# EAGLE board circuit (EAGLE 5.10)
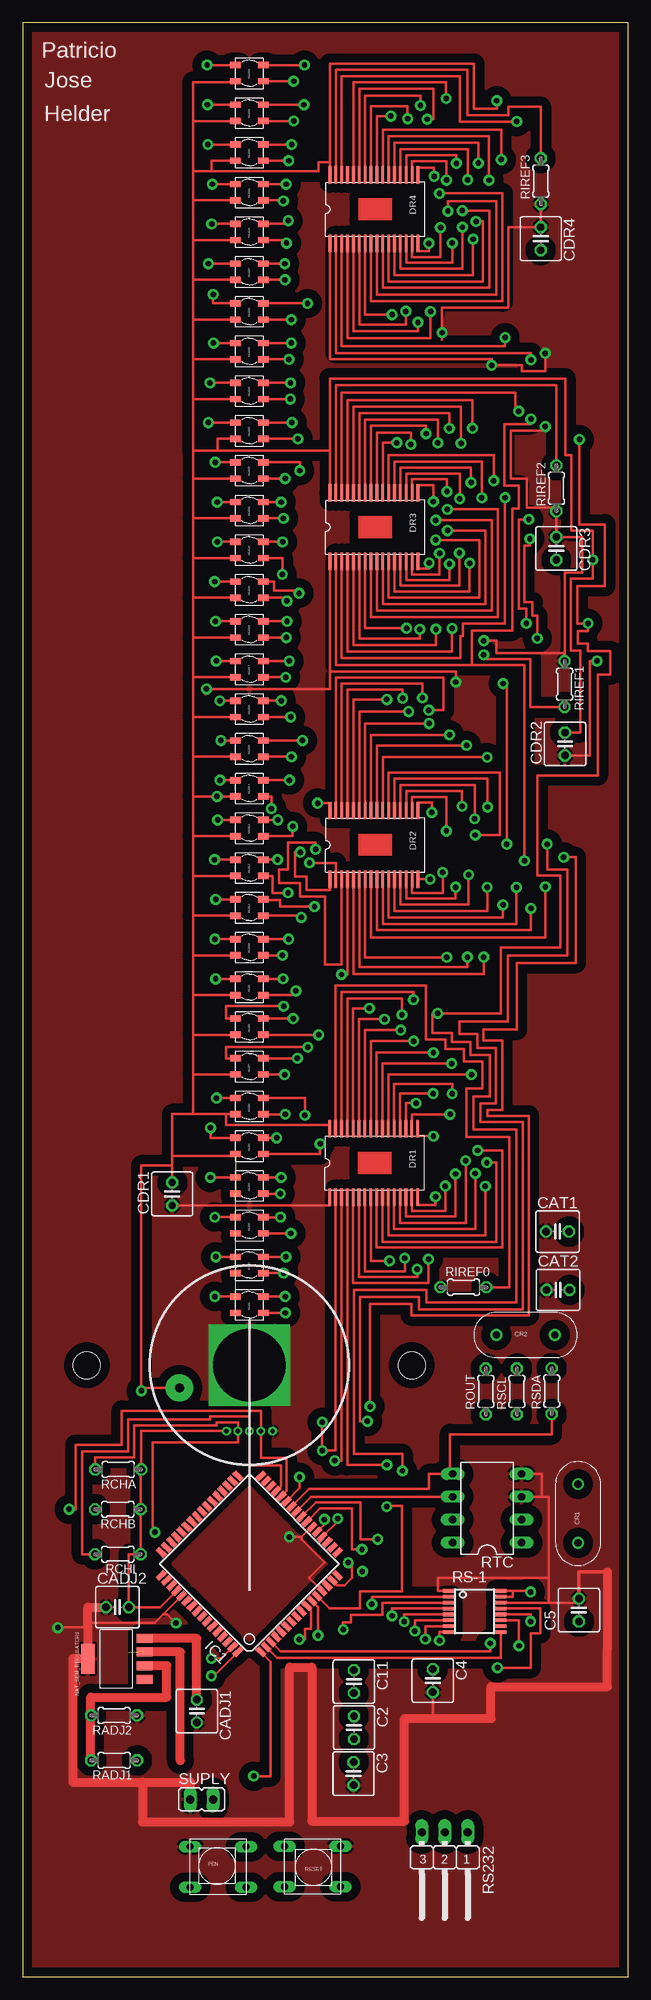
[diagram p1: board, top side]
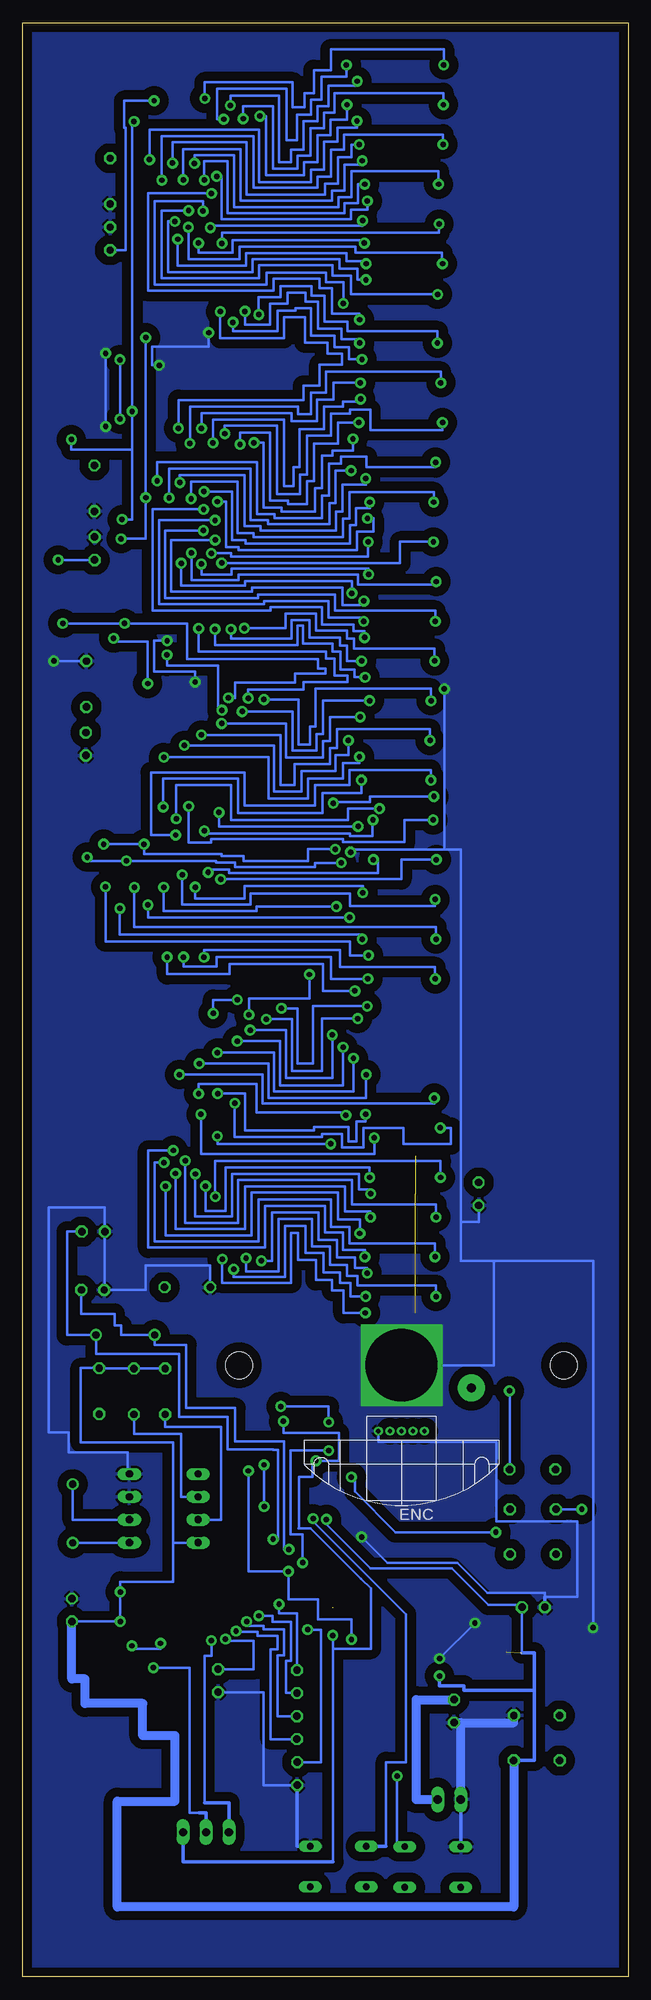
[diagram p2: board, bottom side, seen from below]

Size 67.12 x 216.45 mm. Coordinates in mm from the lower left corner, seen from the top.
Outline: 0,0 67.12,0 67.12,216.45 0,216.45 0,0
Copper layers (1*16): Top 0.035mm / dielectric 1.5mm / Bottom 0.035mm
Design rules "default1 *": minimum track width 10mil, minimum drill 0.6mm, track to track 0.3mm, track to pad 0.3mm, pad to pad 8mil, via to via 8mil, smd to smd 8mil, copper to edge 40mil, drill to drill 8mil, minimum pad ring 10mil, minimum via ring 8mil, stop-mask expansion 4mil, vias tented up to drill 0mil, thermal gap 10mil
Holes 3 mm at 7.13,67.75 43.13,67.75

## Footprints (pad centres in the part's own frame; a part is rotated, then mirrored left to right if it is on the bottom)
CAP = drill 0.813 octagon: 1 -1.27,0; 2 1.27,0
CRYSTAL2 = drill 0.8 round: 1 2.5,2.5; 2 9,2.5
TLC5947 = smd 1.9 x 0.3: 1 -0.8,10.5; 2 -0.8,9.85; 3 -0.8,9.2; 4 -0.8,8.55; 5 -0.8,7.9; 6 -0.8,7.25; 7 -0.8,6.6; 8 -0.8,5.95; 9 -0.8,5.3; 10 -0.8,4.65; 11 -0.8,4; 12 -0.8,3.35; 13 -0.8,2.7; 14 -0.8,2.05; 15 -0.8,1.4; 16 -0.8,0.75; 17 6.8,0.75; 18 6.8,1.4; 19 6.8,2.05; 20 6.8,2.7; 21 6.8,3.35; 22 6.8,4; 23 6.8,4.65; 24 6.8,5.3; 25 6.8,5.95; 26 6.8,6.6; 27 6.8,7.25; 28 6.8,7.9; 29 6.8,8.55; 30 6.8,9.2; 31 6.8,9.85; 32 6.8,10.5
ENCODER-AED8-9140 = drill 0.47 pad 0.7 round: 1 -2.54,-3.7; 2 -1.27,-3.7; 3 0,-3.7; 4 1.27,-3.7; 5 2.57,-3.7
TQFP64 = smd 1.194 x 0.559: 1 -7.8,6; 2 -7.8,5.2; 3 -7.8,4.4; 4 -7.8,3.6; 5 -7.8,2.8; 6 -7.8,2; 7 -7.8,1.2; 8 -7.8,0.4; 9 -7.8,-0.4; 10 -7.8,-1.2; 11 -7.8,-2; 12 -7.8,-2.8; 13 -7.8,-3.6; 14 -7.8,-4.4; 15 -7.8,-5.2; 16 -7.8,-6; 33 7.8,-6; 34 7.8,-5.2; 35 7.8,-4.4; 36 7.8,-3.6; 37 7.8,-2.8; 38 7.8,-2; 39 7.8,-1.2; 40 7.8,-0.4; 41 7.8,0.4; 42 7.8,1.2; 43 7.8,2; 44 7.8,2.8; 45 7.8,3.6; 46 7.8,4.4; 47 7.8,5.2; 48 7.8,6 | smd 0.559 x 1.194: 17 -6,-7.8; 18 -5.2,-7.8; 19 -4.4,-7.8; 20 -3.6,-7.8; 21 -2.8,-7.8; 22 -2,-7.8; 23 -1.2,-7.8; 24 -0.4,-7.8; 25 0.4,-7.8; 26 1.2,-7.8; 27 2,-7.8; 28 2.8,-7.8; 29 3.6,-7.8; 30 4.4,-7.8; 31 5.2,-7.8; 32 6,-7.8; 49 6,7.8; 50 5.2,7.8; 51 4.4,7.8; 52 3.6,7.8; 53 2.8,7.8; 54 2,7.8; 55 1.2,7.8; 56 0.4,7.8; 57 -0.4,7.8; 58 -1.2,7.8; 59 -2,7.8; 60 -2.8,7.8; 61 -3.6,7.8; 62 -4.4,7.8; 63 -5.2,7.8; 64 -6,7.8
NAT_SEM_REGULATOR = smd 1 x 1.75: ADJ -1.25,-3.45; VEN -2.75,-3.45; VIN 1.75,-3.45; VOUT 0.25,-3.45 | smd 3.3 x 1.5: GND -0.5,2.85
PUSH_BUTTON = drill 0.75 long: 1 0,-0.85; 2 0,-5.35; 3 6.2,-0.85; 4 6.2,-5.35
0204/5 = drill 0.813 octagon: 1 -2.54,0; 2 2.54,0
ASMT-QTB0-0AA02-LED = smd 0.7 x 1.2: B 2.6,-0.05; G 2.6,-3.15; R 0.8,-3.15; VCC 0.8,-0.05
JP2W = drill 0.914 long: 1 -2.54,-1.27; 2 0,-1.27; 3 2.54,-1.27
TRS3221 = smd 0.4 x 1.2: 1 -2.275,-2.9; 2 -1.625,-2.9; 3 -0.975,-2.9; 4 -0.325,-2.9; 5 0.325,-2.9; 6 0.975,-2.9; 7 1.625,-2.9; 8 2.275,-2.9; 9 2.275,2.9; 10 1.625,2.9; 11 0.975,2.9; 12 0.325,2.9; 13 -0.325,2.9; 14 -0.975,2.9; 15 -1.625,2.9; 16 -2.275,2.9
DIL08 = drill 0.813 long: 1 -3.81,-3.81; 2 -1.27,-3.81; 3 1.27,-3.81; 4 3.81,-3.81; 5 3.81,3.81; 6 1.27,3.81; 7 -1.27,3.81; 8 -3.81,3.81
JP1 = drill 0.914 long: 1 0,-1.27; 2 0,1.27

## Placement (x,y rotation side)
C2  CAP  [CAP]  36.72,27.61 270 top
C3  CAP  [CAP]  36.68,22.51 270 top
C4  CAP  [CAP]  45.46,32.81 270 top
C5  CAP  [CAP]  61.65,40.63 90 top
C11  CAP  [CAP]  36.71,32.71 270 top
CADJ1  0.1u  [CAP]  19.31,29.44 270 top
CADJ2  0.1u  [CAP]  10.51,40.95 0 top
CAT1  CAP  [CAP]  59.28,82.55 0 top
CAT2  CAP  [CAP]  59.34,76.09 0 top
CDR1  CAP  [CAP]  16.58,86.72 90 top
CDR2  CAP  [CAP]  60.11,136.55 90 top
CDR3  CAP  [CAP]  59.15,158.21 270 top
CDR4  CAP  [CAP]  57.42,192.51 270 top
CR1  37.768k  [CRYSTAL2]  64.06,45.58 90 top
CR2  16MHz  [CRYSTAL2]  49.99,68.59 0 top
DR1  TLC5947  [TLC5947]  44.53,87.15 90 top
DR2  TLC5947  [TLC5947]  44.56,122.37 90 top
DR3  TLC5947  [TLC5947]  44.56,157.57 90 top
DR4  TLC5947  [TLC5947]  44.56,192.78 90 top
ENC  ENCODER-AEDB-9140  [ENCODER-AED8-9140]  25.13,56.75 180 bottom
IC1  MEGA64-A  [TQFP64]  25.13,45.75 135 top
NAT_SEM_REGULATOR1  NAT_SEM_REGULATOR  [NAT_SEM_REGULATOR]  10.08,35.73 90 top
PEN  PUSH_BUTTON  [PUSH_BUTTON]  18.57,15.29 0 top
RADJ1  3.75k  [0204/5]  10.15,23.98 180 top
RADJ2  1.25  [0204/5]  10.14,28.95 180 top
RCHA  2.7k  [0204/5]  10.61,56.2 180 top
RCHB  2.7k  [0204/5]  10.56,51.8 180 top
RCHI  2.7k  [0204/5]  10.56,46.82 180 top
RESET  PUSH_BUTTON  [PUSH_BUTTON]  35.23,9.12 180 top
RGB1  ASMT-QTB0-0AA02-LED  [ASMT-QTB0-0AA02-LED]  23.53,72.75 90 top
RGB2  ASMT-QTB0-0AA02-LED  [ASMT-QTB0-0AA02-LED]  23.53,77.15 90 top
RGB3  ASMT-QTB0-0AA02-LED  [ASMT-QTB0-0AA02-LED]  23.53,81.54 90 top
RGB4  ASMT-QTB0-0AA02-LED  [ASMT-QTB0-0AA02-LED]  23.53,85.94 90 top
RGB5  ASMT-QTB0-0AA02-LED  [ASMT-QTB0-0AA02-LED]  23.53,90.34 90 top
RGB6  ASMT-QTB0-0AA02-LED  [ASMT-QTB0-0AA02-LED]  23.53,94.74 90 top
RGB7  ASMT-QTB0-0AA02-LED  [ASMT-QTB0-0AA02-LED]  23.53,99.14 90 top
RGB8  ASMT-QTB0-0AA02-LED  [ASMT-QTB0-0AA02-LED]  23.53,103.54 90 top
RGB9  ASMT-QTB0-0AA02-LED  [ASMT-QTB0-0AA02-LED]  23.53,107.94 90 top
RGB10  ASMT-QTB0-0AA02-LED  [ASMT-QTB0-0AA02-LED]  23.53,112.34 90 top
RGB11  ASMT-QTB0-0AA02-LED  [ASMT-QTB0-0AA02-LED]  23.53,116.74 90 top
RGB12  ASMT-QTB0-0AA02-LED  [ASMT-QTB0-0AA02-LED]  23.53,121.14 90 top
RGB13  ASMT-QTB0-0AA02-LED  [ASMT-QTB0-0AA02-LED]  23.53,125.54 90 top
RGB14  ASMT-QTB0-0AA02-LED  [ASMT-QTB0-0AA02-LED]  23.53,129.94 90 top
RGB15  ASMT-QTB0-0AA02-LED  [ASMT-QTB0-0AA02-LED]  23.53,134.34 90 top
RGB16  ASMT-QTB0-0AA02-LED  [ASMT-QTB0-0AA02-LED]  23.53,138.74 90 top
RGB17  ASMT-QTB0-0AA02-LED  [ASMT-QTB0-0AA02-LED]  23.53,143.14 90 top
RGB18  ASMT-QTB0-0AA02-LED  [ASMT-QTB0-0AA02-LED]  23.53,147.54 90 top
RGB19  ASMT-QTB0-0AA02-LED  [ASMT-QTB0-0AA02-LED]  23.53,151.94 90 top
RGB20  ASMT-QTB0-0AA02-LED  [ASMT-QTB0-0AA02-LED]  23.53,156.34 90 top
RGB21  ASMT-QTB0-0AA02-LED  [ASMT-QTB0-0AA02-LED]  23.53,160.74 90 top
RGB22  ASMT-QTB0-0AA02-LED  [ASMT-QTB0-0AA02-LED]  23.53,165.15 90 top
RGB23  ASMT-QTB0-0AA02-LED  [ASMT-QTB0-0AA02-LED]  23.53,169.55 90 top
RGB24  ASMT-QTB0-0AA02-LED  [ASMT-QTB0-0AA02-LED]  23.53,173.95 90 top
RGB25  ASMT-QTB0-0AA02-LED  [ASMT-QTB0-0AA02-LED]  23.53,178.35 90 top
RGB26  ASMT-QTB0-0AA02-LED  [ASMT-QTB0-0AA02-LED]  23.53,182.75 90 top
RGB27  ASMT-QTB0-0AA02-LED  [ASMT-QTB0-0AA02-LED]  23.53,187.15 90 top
RGB28  ASMT-QTB0-0AA02-LED  [ASMT-QTB0-0AA02-LED]  23.53,191.55 90 top
RGB29  ASMT-QTB0-0AA02-LED  [ASMT-QTB0-0AA02-LED]  23.53,195.95 90 top
RGB30  ASMT-QTB0-0AA02-LED  [ASMT-QTB0-0AA02-LED]  23.53,200.35 90 top
RGB31  ASMT-QTB0-0AA02-LED  [ASMT-QTB0-0AA02-LED]  23.53,204.75 90 top
RGB32  ASMT-QTB0-0AA02-LED  [ASMT-QTB0-0AA02-LED]  23.53,209.15 90 top
RIREF0  [0204/5]  48.86,76.39 0 top
RIREF1  [0204/5]  60.06,143.19 270 top
RIREF2  [0204/5]  59.16,164.87 90 top
RIREF3  [0204/5]  57.42,198.89 90 top
ROUT  10k  [0204/5]  51.33,64.84 90 top
RS232  [JP2W]  46.79,14.76 180 top
RS-1  TRS3221  [TRS3221]  50.09,40.48 270 top
RSCL  10k  [0204/5]  54.78,64.84 90 top
RSDA  10k  [0204/5]  58.63,64.88 90 top
RTC  [DIL08]  51.48,51.9 90 top
SUPLY  [JP1]  19.84,19.65 270 top

## Tracks (layer width: path | path; a pad name or v marks a point on that pad's centre or on a via)
BLANK  (via drill 0.6 pad 1.2)
  Top 0.3: DR3.2 34.71,145.3 49.77,145.3 | DR4.2 34.71,179.86 56.33,179.86 v56.33,179.1 | 49.77,145.3 55.62,145.3 v55.62,123.61 | 49.77,145.3 49.77,149.13 54.26,149.13 54.26,162.64 55.01,162.64 55.01,165.19 53.39,165.19 53.39,172 56.33,172 v56.33,172.54 | IC1.15 34.85,43.38 35.65,43.38 36.48,44.21 36.48,45.87 v36.08,45.87 | DR1.2 34.68,58.29 v33.2,58.29 v33.2,61.44 | v59.96,124.01 61.28,124.01 61.28,112.31 54.76,112.31 54.76,104.93 51.08,104.93 51.08,103.7 53.14,103.7 53.14,96.02 51.5,96.02 51.5,95.38 56.09,95.38 56.09,73.28 43.09,73.28 43.09,74.56 38.51,74.56 v38.51,63.18 | DR2.2 34.71,123.39 v31.8,123.39
  Bottom 0.3: v56.33,172.54 v56.33,179.1 | v36.08,45.87 36.08,49.03 37.43,49.03 37.43,58.29 v33.2,58.29 | v33.2,61.44 33.2,63.18 v38.51,63.18 | v59.96,124.01 59.96,123.61 v55.62,123.61 45.66,123.61 45.66,123.42 43.56,123.42 43.56,122.9 34.71,122.9 34.71,123.39 v31.8,123.39
C1+  (via drill 0.6 pad 1.2)
  Top 0.3: RS-1.2 38.7,42.1 v38.7,41.28
  Bottom 0.3: v38.7,41.28 38.7,40.28 36.71,40.28 C11.1
C1-  (via drill 0.6 pad 1.2)
  Top 0.3: RS-1.4 40.95,40.8 v40.95,39.99
  Bottom 0.3: v40.95,39.99 39.4,39.99 39.4,39.32 37.39,39.32 37.39,34.99 37.92,34.99 37.92,31.44 C11.2
C2+  (via drill 0.6 pad 1.2)
  Top 0.3: RS-1.5 42.28,40.16 v42.28,39.35
  Bottom 0.3: v42.28,39.35 42.28,38.91 40.44,38.91 40.44,38.52 38.15,38.52 38.15,35.6 38.84,35.6 38.84,28.88 C2.1
C2-  (via drill 0.6 pad 1.2)
  Top 0.3: RS-1.6 43.46,39.5 v43.46,38.31
  Bottom 0.3: v43.46,38.31 43.46,38.23 41.09,38.23 41.09,37.8 38.89,37.8 38.89,36.26 39.64,36.26 39.64,26.34 C2.2
CHA  (via drill 0.6 pad 1.2)
  Top 0.3: RCHA.2 8.07,57.55 12.39,57.55 12.39,61.07 21.52,61.07 21.52,61.4 23.86,61.4 ENC.2 23.86,59.22 14.42,59.22 14.42,49.25 v14.67,49.25 | v30.69,55.35 30.69,54.14 IC1.27
  Bottom 0.3: v14.67,49.25 25.81,49.25 30.31,53.75 30.31,54.97 v30.69,55.35
CHB  (via drill 0.6 pad 1.2)
  Top 0.3: v5.15,51.8 5.87,51.8 5.87,58.92 10.99,58.92 10.99,62.71 26.4,62.71 ENC.4 26.4,57.48 29.25,57.48 29.25,53.83 IC1.28
  Bottom 0.3: v5.15,51.8 RCHB.2
CHI
  Top 0.3: RCHI.2 6.62,46.82 6.62,58.23 11.69,58.23 11.69,61.77 20.77,61.77 20.77,62.07 25.13,62.07 ENC.3 25.13,56.65 28.62,56.65 28.62,54.33 IC1.29
GND  (via drill 0.6 pad 1.2, 8)
  Top 0.3: DR2.1 34.06,120.39 31.46,120.39 31.46,121.85 30.2,121.85 30.2,124.57 v30.77,124.57 | DR4.1 34.06,179.18 51.98,179.18 v51.98,178.5 55.33,178.5 55.33,177.84 57.91,177.84 v57.91,179.83 | 34.06,144.57 DR3.1 | RIREF3.1 CDR4.1 53.85,193.77 53.85,184.87 46.49,184.87 v46.49,182.11 46.49,181.31 | v57.91,171.71 57.91,171.23 54.12,171.23 54.12,165.93 55.9,165.93 55.9,162.75 59.16,162.75 RIREF2.1 CDR3.1 62.03,159.48 62.03,155.54 60.06,155.54 RIREF1.1 60.06,146.62 52.53,146.62 52.53,147.99 v51.1,147.99 | 34.06,144.57 48,144.57 v48,143.41 | CDR2.1 62.86,135.28 62.86,145.74 v63.65,145.74 | 58.3,41.45 RS-1.14 | 58.3,41.45 61.65,41.45 | 15.56,40.14 14.65,39.23 7.23,39.23 | 15.56,40.14 IC1.53 | IC1.63 21.99,35.26 v20.92,35.26 | v17,39.18 16.04,40.14 15.56,40.14 | DR1.1 34.03,85.45 CDR1.1 | 30.93,48.72 IC1.22 | v29.56,48.72 30.93,48.72 | RTC.4 57.53,55.71 57.53,53.18 RTC.3 58.3,53.17 58.3,44.21 | 58.3,44.21 58.3,41.45 | C4.2 45.45,28.63 | RS-1.1 46.04,42.75 46.04,44.21 58.3,44.21 | 30.93,48.72 30.93,48.46 33.46,45.93 31.81,44.28 31.81,44.17 IC1.13 | v3.9,38.68 3.9,38.74 7.23,38.74 | 34.06,144.57 34.06,142.65 v20.38,142.65
  Top 0.406: 61.65,41.45 C5.2 61.65,44.84 64.81,44.84 | 42.89,28.63 45.45,28.63
  Top 1: CADJ2.1 7.23,40.95 7.23,39.23 7.23,38.74 NAT_SEM_REGULATOR1.GND 5.58,35.23 5.58,21.58 13.28,21.58 | 13.28,21.58 18.57,21.58 SUPLY.1 | 13.28,21.58 13.28,17.16 29.59,17.16 29.59,34.3 32.07,34.3 32.07,17.24 42.34,17.24 42.34,28.63 42.89,28.63 51.92,28.63 51.92,32.14 64.81,32.14 64.81,36.34 | 64.81,44.84 64.81,36.41
  Bottom 0.3: v30.77,124.57 30.77,124.84 20.38,124.84 | v51.98,178.5 52.74,178.5 52.74,180.54 46.49,180.54 v46.49,182.11 | v57.91,179.83 v57.91,171.71 | v48,143.41 48,144.56 52.52,144.56 52.52,147.99 v51.1,147.99 | RIREF1.1 v63.65,145.73 v63.65,145.74 | C3.2 40.4,21.24 40.4,31.54 C4.2 | v17,39.18 v20.92,35.26 | v29.56,48.72 26.71,45.87 18.95,45.87 15.59,42.51 9.24,42.51 9.24,42.08 5.66,42.08 5.66,50.48 14.6,50.48 14.6,59.26 27.7,59.26 ENC.5 | RTC.4 55.45,55.71 55.45,58.1 62.01,58.1 62.01,60.3 64.21,60.3 64.21,85.22 58.01,85.22 CAT1.1 58.01,76.09 | 18.55,83.62 18.55,79.31 14.88,79.31 | 18.55,83.62 18.55,124.84 20.38,124.84 | 14.88,79.31 3.9,79.31 v3.9,38.68 | CDR1.1 16.58,83.62 18.55,83.62 | v20.38,142.65 20.38,124.84 | 14.88,79.31 14.88,67.75 v25.13,67.75 | 58.01,76.09 CAT2.1 | 58.01,76.09 53.49,76.09 53.49,78.82 46.32,78.82 RIREF0.1
  Bottom 0.406: SUPLY.1 PEN.1 | CADJ2.1 9.24,42.08 | C3.2 36.68,14.47 RESET.2
  Bottom 1: RADJ2.1 12.68,28.17 CADJ1.2 18.57,28.17 SUPLY.1
  pour Bottom (isolate 1): 0.53,216.15 66.53,216.15 66.53,1.15 0.53,1.15
  pour Top (isolate 1): 0.53,216.15 66.53,216.15 66.53,1.15 0.53,1.15
IREF0
  Top 0.3: DR1.31 34.68,109.81 44.69,109.81 44.69,103.82 46.83,103.82 46.83,102.78 48.9,102.78 48.9,101.39 50.98,101.39 50.98,98.39 49.17,98.39 49.17,93.05 53.96,93.05 53.96,76.39 RIREF0.2
IREF1  (via drill 0.6 pad 1.2)
  Top 0.3: DR2.31 34.71,143.91 | 34.71,143.91 34.71,143.92 | 34.71,143.91 46.65,143.91 46.65,140.3 v45.02,140.3 | v51.11,146.43 51.11,145.97 56.29,145.97 56.29,140.65 RIREF1.2
  Bottom 0.3: v45.02,140.3 45.46,140.3 45.46,145.23 51.11,145.23 v51.11,146.43
IREF2
  Top 0.3: DR3.31 34.71,176.29 59.16,176.29 RIREF2.2
IREF3
  Top 0.3: DR4.31 34.71,211.21 49.3,211.21 49.3,206.2 53.84,206.2 53.84,207.11 57.42,207.11 RIREF3.2
LED0  (via drill 0.6 pad 1.2)
  Top 0.3: DR1.5 36.63,76.88 44.99,76.88 v44.99,79.5 | v29.13,73.54 v29.13,73.55 RGB1.R
  Bottom 0.3: v44.99,79.5 44.99,76.88 37.35,76.88 37.35,82.42 36.59,82.42 36.59,79.43 34.61,79.43 34.61,77.19 32.81,77.19 32.81,76.02 31.54,76.02 31.54,73.54 v29.13,73.54
LED1  (via drill 0.6 pad 1.2)
  Top 0.3: DR1.6 37.28,77.51 43.73,77.51 v43.73,78.37 v43.72,78.37 | RGB1.G v29.1,75.35
  Bottom 0.3: v43.72,78.37 43.72,77.51 38.06,77.51 38.06,83.19 35.79,83.19 35.79,80.19 33.79,80.19 33.79,78.02 31.97,78.02 31.97,76.85 30.77,76.85 30.77,75.35 v29.1,75.35
LED2  (via drill 0.6 pad 1.2)
  Top 0.3: DR1.7 37.93,78.16 42.35,78.16 v42.35,79.61 | v21.3,75.35 RGB1.B
  Bottom 0.3: v42.35,79.61 42.35,78.16 38.76,78.16 38.76,83.94 35.07,83.94 35.07,80.92 33.04,80.92 33.04,78.84 31.17,78.84 31.17,77.64 30,77.64 30,76.59 21.3,76.59 v21.3,75.35
LED3  (via drill 0.6 pad 1.2)
  Top 0.3: DR1.8 38.58,79.31 v40.67,79.31 | RGB2.R v28.93,77.95
  Bottom 0.3: v40.67,79.31 39.49,79.31 39.49,84.66 34.33,84.66 34.33,81.64 32.27,81.64 32.27,79.69 30.3,79.69 30.3,78.55 28.93,78.55 v28.93,77.95
LED4  (via drill 0.6 pad 1.2)
  Top 0.3: DR1.9 39.23,80.77 53.19,80.77 53.19,91.52 v50.42,91.52 v50.42,91.53 | RGB2.G v29.19,79.75
  Bottom 0.3: v50.42,91.53 53.19,91.53 53.19,80.77 40.25,80.77 40.25,85.4 33.63,85.4 33.63,82.45 31.59,82.45 31.59,80.52 29.19,80.52 v29.19,79.75
LED5  (via drill 0.6 pad 1.2)
  Top 0.3: DR1.10 39.88,81.42 52.49,81.42 52.49,90.2 v51.45,90.2 | v21.41,79.75 RGB2.B
  Bottom 0.3: v51.45,90.2 52.5,90.2 52.5,81.44 40.99,81.44 40.99,86.12 32.92,86.12 32.92,83.08 30.88,83.08 30.88,81.25 21.41,81.25 v21.41,79.75
LED6  (via drill 0.6 pad 1.2)
  Top 0.3: DR1.11 40.53,82.13 51.28,82.13 v51.28,87.57 | RGB3.R v29.74,82.34
  Bottom 0.3: v51.28,87.57 51.28,82.14 41.76,82.14 41.76,86.86 32.14,86.86 32.14,83.87 29.74,83.87 v29.74,82.34
LED7  (via drill 0.6 pad 1.2)
  Top 0.3: DR1.12 41.18,82.86 50.17,82.86 v50.17,88.99 | RGB3.G v28.57,84.14
  Bottom 0.3: v50.17,88.99 50.17,82.86 42.49,82.86 42.49,87.56 31.37,87.56 31.37,84.77 28.57,84.77 v28.57,84.14
LED8  (via drill 0.6 pad 1.2)
  Top 0.3: DR1.13 41.83,83.53 49.1,83.53 v49.1,90.4 | v21.3,84.15 RGB3.B
  Bottom 0.3: v49.1,90.4 49.1,83.53 43.22,83.53 43.22,88.27 30.59,88.27 30.59,85.57 21.3,85.57 v21.3,84.15
LED9  (via drill 0.6 pad 1.2)
  Top 0.3: DR1.14 42.48,84.2 47.98,84.2 v47.98,88.93 | RGB4.R v28.55,86.74
  Bottom 0.3: v47.98,88.93 47.98,84.2 43.9,84.2 43.9,88.93 29.82,88.93 29.82,87.22 28.55,87.22 v28.55,86.74
LED10  (via drill 0.6 pad 1.2)
  Top 0.3: DR1.15 43.13,84.83 46.85,84.83 v46.85,87.59 | RGB4.G v28.66,88.54
  Bottom 0.3: v46.85,87.59 46.85,84.85 44.62,84.85 44.62,89.63 28.66,89.63 v28.66,88.54
LED11  (via drill 0.6 pad 1.2)
  Top 0.3: DR1.16 43.78,85.51 45.77,85.51 v45.77,86.42 v45.76,86.42 | v20.8,88.54 RGB4.B
  Bottom 0.3: v45.76,86.42 45.76,90.37 20.8,90.37 v20.8,88.54
LED12  (via drill 0.6 pad 1.2)
  Top 0.3: DR1.17 43.78,93.12 v45.53,93.12 | v32.97,92.27 32.97,91.14 RGB5.R
  Bottom 0.3: v45.53,93.12 45.53,92.27 v32.97,92.27
LED13  (via drill 0.6 pad 1.2)
  Top 0.3: DR1.18 43.13,95.53 v47.36,95.53 | v28.16,92.93 RGB5.G
  Bottom 0.3: v47.36,95.53 47.36,91.14 28.15,91.14 v28.15,92.93 v28.16,92.93
LED14  (via drill 0.6 pad 1.2)
  Top 0.3: DR1.19 42.48,96.77 v43.6,96.77 | v20.83,94.03 20.83,92.94 RGB5.B
  Bottom 0.3: v43.6,96.77 43.6,93.05 33.93,93.05 33.93,93.35 31.73,93.35 31.73,91.85 29.33,91.85 29.33,94.05 24.93,94.05 24.93,92.25 19.63,92.25 19.63,94.03 v20.83,94.03
LED15  (via drill 0.6 pad 1.2)
  Top 0.3: DR1.20 41.83,97.83 v45.5,97.83 | RGB6.R v29.11,95.54
  Bottom 0.3: v45.5,97.83 42.47,97.83 42.47,93.75 34.83,93.75 34.83,94.15 31.03,94.15 31.03,92.55 30.13,92.55 30.13,94.75 29.11,94.75 v29.11,95.54
LED16  (via drill 0.6 pad 1.2)
  Top 0.3: DR1.21 41.18,98.9 47.61,98.9 v47.61,97.82 | v31.29,95.44 31.29,97.34 RGB6.G
  Bottom 0.3: v31.29,95.44 31.29,95.74 41.17,95.74 41.17,98.9 47.61,98.9 v47.61,97.82
LED17  (via drill 0.6 pad 1.2)
  Top 0.3: DR1.22 40.53,99.93 v49.74,99.93 | v21.49,97.34 RGB6.B
  Bottom 0.3: v49.74,99.93 40.53,99.93 40.53,96.72 21.49,96.72 v21.49,97.34
LED18  (via drill 0.6 pad 1.2)
  Top 0.3: DR1.23 39.88,101.15 v47.54,101.15 | v29.04,99.94 RGB7.R
  Bottom 0.3: v47.54,101.15 39.88,101.15 39.88,97.35 29.04,97.35 v29.04,99.94
LED19  (via drill 0.6 pad 1.2)
  Top 0.3: DR1.24 39.23,102.36 v45.53,102.36 | v30.45,101.74 RGB7.G
  Bottom 0.3: v45.53,102.36 39.23,102.36 39.23,98.04 30.45,98.04 v30.45,101.74
LED20  (via drill 0.6 pad 1.2)
  Top 0.3: DR1.25 38.58,103.64 v43.34,103.64 | v31.6,102.97 22.53,102.97 22.53,101.74 RGB7.B
  Bottom 0.3: v43.34,103.64 38.58,103.64 38.58,98.75 31.6,98.75 v31.6,102.97
LED21  (via drill 0.6 pad 1.2)
  Top 0.3: DR1.26 37.93,104.86 v41.9,104.86 | RGB8.R v32.8,104.34
  Bottom 0.3: v41.9,104.86 37.93,104.86 37.93,99.57 32.8,99.57 v32.8,104.34
LED22  (via drill 0.6 pad 1.2)
  Top 0.3: DR1.27 37.28,106.07 v40.11,106.07 | RGB8.G v29.98,106.14
  Bottom 0.3: v40.11,106.07 37.28,106.07 37.28,100.35 33.94,100.35 33.94,106.14 v29.98,106.14
LED23  (via drill 0.6 pad 1.2)
  Top 0.3: DR1.28 36.63,107.28 v38.43,107.28 | v28.93,107.51 22.55,107.51 22.55,106.14 RGB8.B
  Bottom 0.3: v38.43,107.28 36.63,107.28 36.63,101.18 34.95,101.18 34.95,107.51 v28.93,107.51
LED24  (via drill 0.6 pad 1.2)
  Top 0.3: DR2.5 36.66,111.05 51.1,111.05 v51.1,112.95 | v30.29,109.21 30.29,108.74 RGB9.R
  Bottom 0.3: v51.1,112.95 51.1,111.06 44.2,111.06 44.2,112.17 33.81,112.17 33.81,109.21 v30.29,109.21
LED25  (via drill 0.6 pad 1.2)
  Top 0.3: DR2.6 37.31,111.87 49.29,111.87 v49.29,112.94 | v28.86,110.55 v28.86,110.54 RGB9.G
  Bottom 0.3: v49.29,112.94 49.29,111.88 45.6,111.88 45.6,112.94 32.97,112.94 32.97,110.55 v28.86,110.55
LED26  (via drill 0.6 pad 1.2)
  Top 0.3: DR2.7 37.96,112.93 v47.01,112.93 | v21.39,110.54 RGB9.B
  Bottom 0.3: v47.01,112.93 47.01,113.72 31.96,113.72 31.96,111.84 21.41,111.84 21.41,110.54 v21.39,110.54
LED27  (via drill 0.6 pad 1.2)
  Top 0.3: DR2.8 38.61,115.13 57.94,115.13 v57.94,120.73 v57.93,120.73 | v28.79,113.15 v28.79,113.14 RGB10.R
  Bottom 0.3: v57.93,120.73 57.93,114.68 30.84,114.68 30.84,113.15 v28.79,113.15
LED28  (via drill 0.6 pad 1.2)
  Top 0.3: DR2.9 39.26,115.94 56.35,115.94 v56.35,118.34 v56.34,118.34 | RGB10.G v29.49,114.94
  Bottom 0.3: v56.34,118.34 56.34,115.43 29.49,115.43 v29.49,114.94
LED29  (via drill 0.6 pad 1.2)
  Top 0.3: DR2.10 39.91,116.63 54.73,116.63 v54.73,120.67 | v21.31,114.94 RGB10.B
  Bottom 0.3: v54.73,120.67 54.73,116.29 21.3,116.29 v21.3,114.94 v21.31,114.94
LED30  (via drill 0.6 pad 1.2)
  Top 0.3: DR2.11 40.56,117.35 53.23,117.35 v53.23,118.73 | v30.88,117.35 30.88,117.54 RGB11.R
  Bottom 0.3: v53.23,118.73 53.23,117.35 v30.88,117.35
LED31  (via drill 0.6 pad 1.2)
  Top 0.3: DR2.12 41.21,118.06 51.48,118.06 v51.48,120.68 | v32.35,118.54 28.55,118.54 28.55,119.29 26.68,119.29 RGB11.G
  Bottom 0.3: v51.48,120.68 51.48,118.07 41.21,118.07 41.21,118.54 v32.35,118.54
LED32  (via drill 0.6 pad 1.2)
  Top 0.3: DR2.13 41.86,118.77 49.43,118.77 v49.43,122.06 | v21.4,119.34 RGB11.B
  Bottom 0.3: v49.43,122.06 49.43,118.77 41.86,118.77 41.86,120.01 30.86,120.01 30.86,118.61 21.4,118.61 v21.4,119.34
LED33  (via drill 0.6 pad 1.2)
  Top 0.3: DR2.14 42.51,119.44 47.99,119.44 v47.99,120.7 | v29.42,120.07 27.72,120.07 27.72,121.94 RGB12.R
  Bottom 0.3: v47.99,120.7 47.99,119.44 42.52,119.44 42.52,120.8 29.42,120.8 v29.42,120.07
LED34  (via drill 0.6 pad 1.2)
  Top 0.3: DR2.15 43.16,120.07 46.56,120.07 v46.56,122.33 | RGB12.G v28.25,123.74
  Bottom 0.3: v46.56,122.33 46.56,122.66 44.23,122.66 44.23,122.25 27.74,122.25 27.74,123.74 v28.25,123.74
LED35  (via drill 0.6 pad 1.2)
  Top 0.3: v45.17,121.57 DR2.16 | v21.27,123.74 RGB12.B
  Bottom 0.3: v45.17,121.57 25.15,121.57 25.15,123.74 v21.27,123.74
LED36  (via drill 0.6 pad 1.2)
  Top 0.3: DR2.17 43.81,130.05 45.35,130.05 v45.35,128.97 | v29.94,127.42 29.94,126.34 RGB13.R
  Bottom 0.3: v45.35,128.97 45.35,127.42 v29.94,127.42
LED37  (via drill 0.6 pad 1.2)
  Top 0.3: DR2.18 43.16,130.68 46.97,130.68 v46.97,126.92 | v28.29,128.14 RGB13.G
  Bottom 0.3: 46.97,126.65 v46.97,126.92 | v28.29,128.14 28.34,128.14 28.34,126.35 30.83,126.35 30.83,126.65 46.97,126.65 | 46.97,126.65 46.97,126.35
LED38  (via drill 0.6 pad 1.2)
  Top 0.3: DR2.19 42.51,131.33 48.71,131.33 v48.71,129.65 | RGB13.B v21.62,128.14
  Bottom 0.3: v21.62,128.14 24.78,128.14 24.78,125.69 31.63,125.69 31.63,126.05 46.23,126.05 46.23,125.65 48.71,125.65 v48.71,129.65
LED39  (via drill 0.6 pad 1.2)
  Top 0.3: DR2.20 41.86,132.01 50.1,132.01 v50.1,128.27 | v27.57,129.39 27.57,130.74 RGB14.R
  Bottom 0.3: v50.1,128.27 50.1,132.01 43.99,132.01 43.99,128.14 31.04,128.14 31.04,129.39 v27.57,129.39
LED40  (via drill 0.6 pad 1.2)
  Top 0.3: DR2.21 41.21,132.7 51.53,132.7 v51.53,129.57 | RGB14.G v29.57,132.54
  Bottom 0.3: v51.53,129.57 51.53,132.7 43.22,132.7 43.22,128.91 33.9,128.91 33.9,131.14 29.57,131.14 v29.57,132.54
LED41  (via drill 0.6 pad 1.2)
  Top 0.3: DR2.22 40.56,133.41 52.9,133.41 52.9,126.47 v50.16,126.47 | RGB14.B v21.87,132.54
  Bottom 0.3: v50.16,126.47 52.9,126.47 52.9,133.41 42.51,133.41 42.51,129.74 34.72,129.74 34.72,131.99 30.91,131.99 30.91,133.68 21.87,133.68 v21.87,132.54
LED42  (via drill 0.6 pad 1.2)
  Top 0.3: DR2.23 39.91,135.08 v51.47,135.08 | RGB15.R v29.79,135.14
  Bottom 0.3: v51.47,135.08 39.89,135.08 39.89,130.51 35.48,130.51 35.48,132.73 31.62,132.73 31.62,134.43 29.79,134.43 v29.79,135.14
LED43  (via drill 0.6 pad 1.2)
  Top 0.3: DR2.24 39.26,136.4 v49.19,136.4 | RGB15.G v31.01,136.94
  Bottom 0.3: v49.19,136.4 39.23,136.4 39.23,131.31 36.22,131.31 36.22,133.54 32.42,133.54 32.42,135.3 31.01,135.3 v31.01,136.94
LED44  (via drill 0.6 pad 1.2)
  Top 0.3: DR2.25 38.61,137.56 v47.31,137.56 | RGB15.B v21.97,136.94
  Bottom 0.3: v47.31,137.56 38.56,137.56 38.56,132.02 36.96,132.02 36.96,134.33 33.07,134.33 33.07,136.11 32.27,136.11 32.27,138.18 21.97,138.18 v21.97,136.94
LED45  (via drill 0.6 pad 1.2)
  Top 0.3: DR2.26 37.96,138.82 v45.05,138.82 | v29.7,139.54 RGB16.R
  Bottom 0.3: v45.05,138.82 37.9,138.82 37.9,135.04 33.82,135.04 33.82,136.88 33.07,136.88 33.07,139.54 v29.7,139.54
LED46  (via drill 0.6 pad 1.2)
  Top 0.3: DR2.27 37.31,140.16 v42.79,140.16 | v28.67,141.35 v28.67,141.34 RGB16.G
  Bottom 0.3: v42.79,140.16 37.2,140.16 37.2,135.8 34.55,135.8 34.55,137.65 33.82,137.65 33.82,141.35 v28.67,141.35
LED47  (via drill 0.6 pad 1.2)
  Top 0.3: DR2.28 36.66,141.48 v40.37,141.48 | RGB16.B v21.86,141.34
  Bottom 0.3: v40.37,141.48 36.52,141.48 36.52,136.48 35.28,136.48 35.28,138.46 34.64,138.46 34.64,142.67 21.86,142.67 v21.86,141.34
LED48  (via drill 0.6 pad 1.2)
  Top 0.3: DR3.5 36.66,147.53 45.8,147.53 v45.8,149.26 | RGB17.R v29.17,143.94
  Bottom 0.3: v45.8,149.26 45.8,147.53 36.66,147.53 36.66,149.64 36.02,149.64 36.02,147.67 32.78,147.67 32.78,146.8 31.87,146.8 31.87,144.79 30.34,144.79 30.34,143.94 v29.17,143.94
LED49  (via drill 0.6 pad 1.2)
  Top 0.3: DR3.6 37.31,148.2 44.02,148.2 v44.02,149.25 | RGB17.G v29.55,145.74
  Bottom 0.3: v29.55,145.74 31.18,145.74 31.18,147.47 31.97,147.47 31.97,148.33 35.32,148.33 35.32,150.3 37.31,150.3 37.31,148.2 43.88,148.2 44.02,148.2 v44.02,149.25
LED50  (via drill 0.6 pad 1.2)
  Top 0.3: DR3.7 37.96,149.38 v42.55,149.38 | v21.46,145.74 RGB17.B
  Bottom 0.3: v42.55,149.38 37.96,149.38 37.96,151.02 34.59,151.02 34.59,149.1 31.17,149.1 31.17,148.25 30.4,148.25 30.4,147.09 21.46,147.09 v21.46,145.74
LED51  (via drill 0.6 pad 1.2)
  Top 0.3: DR3.8 38.61,150.59 52.69,150.59 52.69,162.54 v47.06,162.54 | RGB18.R v29.22,148.34
  Bottom 0.3: v47.06,162.54 52.69,162.54 52.69,151.34 39.66,151.34 39.66,151.73 33.93,151.73 33.93,149.8 30.44,149.8 30.44,149.08 29.22,149.08 v29.22,148.34
LED52  (via drill 0.6 pad 1.2)
  Top 0.3: DR3.9 39.26,151.34 51.99,151.34 51.99,161.34 v45.79,161.34 | RGB18.G v29.31,150.14
  Bottom 0.3: v45.79,161.34 51.99,161.34 51.99,152.03 40.37,152.03 40.37,152.4 33.23,152.4 33.23,150.55 29.31,150.55 v29.31,150.14
LED53  (via drill 0.6 pad 1.2)
  Top 0.3: DR3.10 39.91,152.03 51.31,152.03 51.31,160.19 v47.09,160.19 | v21.38,150.14 RGB18.B
  Bottom 0.3: v47.09,160.19 51.31,160.19 51.31,152.73 41.02,152.73 41.02,153.08 32.48,153.08 32.48,151.31 21.38,151.31 v21.38,150.14
LED54  (via drill 0.6 pad 1.2)
  Top 0.3: DR3.11 40.56,152.74 50.64,152.74 50.64,159.14 v45.77,159.14 | v29.3,152.39 29.3,152.74 RGB19.R
  Bottom 0.3: v45.77,159.14 50.64,159.14 50.64,153.42 41.71,153.42 41.71,153.87 31.69,153.87 31.69,151.95 29.3,151.95 v29.3,152.39
LED55  (via drill 0.6 pad 1.2)
  Top 0.3: DR3.12 41.21,153.42 49.54,153.42 v49.54,156.57 | RGB19.G 27.88,154.53 27.88,153.55 30.63,153.55 v30.63,153.25
  Bottom 0.3: v49.54,156.57 49.54,154.08 42.44,154.08 42.44,154.58 30.63,154.58 v30.63,153.25
LED56  (via drill 0.6 pad 1.2)
  Top 0.3: DR3.13 41.86,154.08 48.41,154.08 v48.41,157.71 | v21.29,154.54 RGB19.B
  Bottom 0.3: v48.41,157.71 48.41,154.7 43.16,154.7 43.16,155.3 29.93,155.3 29.93,154.22 21.26,154.22 21.26,154.54 v21.29,154.54
LED57  (via drill 0.6 pad 1.2)
  Top 0.3: DR3.14 42.51,154.7 47.3,154.7 v47.3,156.49 | v28.78,155.33 28.78,157.14 RGB20.R
  Bottom 0.3: v47.3,156.49 v47.29,156.49 47.29,155.33 43.96,155.33 43.96,155.95 28.78,155.95 v28.78,155.33
LED58  (via drill 0.6 pad 1.2)
  Top 0.3: DR3.15 43.16,155.32 46.2,155.32 v46.2,157.67 | RGB20.G v28.82,158.94
  Bottom 0.3: v46.2,157.67 44.04,157.67 44.04,157.28 28.82,157.28 v28.82,158.94
LED59  (via drill 0.6 pad 1.2)
  Top 0.3: DR3.16 43.81,155.95 45.05,155.95 v45.05,156.59 | RGB20.B v21.59,158.94
  Bottom 0.3: v45.05,156.59 25.29,156.59 25.29,158.94 v21.59,158.94
LED60  (via drill 0.6 pad 1.2)
  Top 0.3: DR3.17 43.81,165.2 45.52,165.2 v45.52,163.39 | RGB21.R v28.9,161.54
  Bottom 0.3: v45.52,163.39 44.58,163.39 44.58,158.35 43.16,158.35 43.16,158.03 30.09,158.03 30.09,160.09 28.24,160.09 28.24,161.54 v28.9,161.54
LED61  (via drill 0.6 pad 1.2)
  Top 0.3: DR3.18 43.16,165.86 47.02,165.86 v47.02,164.51 | v28.65,163.34 RGB21.G
  Bottom 0.3: v47.02,164.51 43.9,164.51 43.9,159.11 42.39,159.11 42.39,158.77 30.85,158.77 30.85,160.81 30.16,160.81 30.16,162.7 28.65,162.7 v28.65,163.34
LED62  (via drill 0.6 pad 1.2)
  Top 0.3: DR3.19 42.51,166.49 48.44,166.49 v48.44,163.72 | v21.56,163.34 RGB21.B
  Bottom 0.3: v48.44,163.72 48.44,165.62 43.27,165.62 43.27,159.91 41.55,159.91 41.55,159.46 31.63,159.46 31.63,161.53 30.9,161.53 30.9,164.42 21.56,164.42 v21.56,163.34
LED63  (via drill 0.6 pad 1.2)
  Top 0.3: DR3.20 41.86,167.16 49.69,167.16 v49.69,165.51 | v29.09,165.95 RGB22.R
  Bottom 0.3: v49.69,165.51 49.69,166.34 42.5,166.34 42.5,160.69 40.75,160.69 40.75,160.19 32.37,160.19 32.37,162.27 31.68,162.27 31.68,165.29 29.09,165.29 v29.09,165.95
LED64  (via drill 0.6 pad 1.2)
  Top 0.3: DR3.21 41.21,167.83 50.88,167.83 v50.88,163.81 | v30.72,166.83 30.72,167.75 RGB22.G
  Bottom 0.3: v50.88,163.81 50.88,167.05 41.83,167.05 41.83,161.37 39.93,161.37 39.93,160.93 33.09,160.93 33.09,163.23 32.45,163.23 32.45,166.83 v30.72,166.83
LED65  (via drill 0.6 pad 1.2)
  Top 0.3: DR3.22 40.56,168.54 52.21,168.54 v52.21,165.71 | v21.35,167.75 RGB22.B
  Bottom 0.3: v52.21,165.71 52.21,167.78 41.13,167.78 41.13,162.03 39.18,162.03 39.18,161.59 33.96,161.59 33.96,164.05 33.18,164.05 33.18,167.61 31.82,167.61 31.82,168.35 28.99,168.35 28.99,167.21 21.35,167.21 v21.35,167.75
LED66  (via drill 0.6 pad 1.2)
  Top 0.3: DR3.23 39.91,169.91 v41.48,169.91 | v30.51,170.35 RGB23.R
  Bottom 0.3: v41.48,169.91 40.41,169.91 40.41,162.73 38.41,162.73 38.41,162.28 34.71,162.28 34.71,164.91 33.93,164.91 33.93,168.46 32.79,168.46 32.79,169.05 30.51,169.05 v30.51,170.35
LED67  (via drill 0.6 pad 1.2)
  Top 0.3: DR3.24 39.26,171.03 43.02,171.03 v43.02,169.73 | RGB23.G v29.85,172.15
  Bottom 0.3: v43.02,169.73 43.02,171.04 39.71,171.04 39.71,163.5 37.68,163.5 37.68,163.14 35.61,163.14 35.61,165.68 34.82,165.68 34.82,169.83 32.15,169.83 32.15,172.15 v29.85,172.15
LED68  (via drill 0.6 pad 1.2)
  Top 0.3: DR3.25 38.61,171.79 44.71,171.79 v44.71,170.92 | v20.59,172.15 RGB23.B
  Bottom 0.3: v44.71,170.92 44.71,171.79 38.91,171.79 38.91,164.24 36.36,164.24 36.36,166.38 35.59,166.38 35.59,170.7 32.93,170.7 32.93,173.11 30.82,173.11 30.82,173.58 28.59,173.58 28.59,171.32 20.59,171.32 v20.59,172.15
LED69  (via drill 0.6 pad 1.2)
  Top 0.3: DR3.26 37.96,172.47 46.02,172.47 v46.02,169.89 | RGB24.R v29.67,174.75
  Bottom 0.3: v46.02,169.89 46.02,172.47 38.14,172.47 38.14,165.1 37.12,165.1 37.12,167.21 36.42,167.21 36.42,171.4 33.71,171.4 33.71,173.93 31.6,173.93 31.6,174.44 29.67,174.44 v29.67,174.75
LED70  (via drill 0.6 pad 1.2)
  Top 0.3: DR3.27 37.31,173.21 47.29,173.21 v47.29,171.51 | v29.69,176.55 RGB24.G
  Bottom 0.3: v47.29,171.51 47.29,173.21 37.31,173.21 37.31,172.33 34.47,172.33 34.47,174.68 32.64,174.68 32.64,176.55 v29.69,176.55
LED71  (via drill 0.6 pad 1.2)
  Top 0.3: DR3.28 36.66,173.9 48.58,173.9 v48.58,169.84 | v20.77,176.55 RGB24.B
  Bottom 0.3: v48.58,169.84 48.58,173.9 36.6,173.9 36.6,173.08 35.16,173.08 35.16,175.46 33.48,175.46 33.48,177.78 20.77,177.78 v20.77,176.55
LED72  (via drill 0.6 pad 1.2)
  Top 0.3: DR4.5 36.66,182.27 43.81,182.27 v43.81,183.26 | RGB25.R v29.51,179.15
  Bottom 0.3: v43.81,183.26 43.81,182.27 38.89,182.27 38.89,184.56 36.88,184.56 36.88,184.82 35.17,184.82 35.17,181.77 32.54,181.77 32.54,180.5 30.97,180.5 30.97,179.15 v29.51,179.15
LED73  (via drill 0.6 pad 1.2)
  Top 0.3: DR4.6 37.31,182.98 42.47,182.98 v42.47,184.47 | RGB25.G v29.77,180.95
  Bottom 0.3: v42.47,184.47 42.47,182.98 39.7,182.98 39.7,185.29 37.76,185.29 37.76,186.53 35.79,186.53 35.79,185.54 34.4,185.54 34.4,182.53 31.78,182.53 31.78,181.38 29.77,181.38 v29.77,180.95
LED74  (via drill 0.6 pad 1.2)
  Top 0.3: DR4.7 37.96,184.11 v40.95,184.11 | v21.15,180.95 RGB25.B
  Bottom 0.3: v40.95,184.11 40.95,186.02 38.52,186.02 38.52,187.25 35.08,187.25 35.08,186.2 33.64,186.2 33.64,183.32 31.12,183.32 31.12,182.27 21.15,182.27 v21.15,180.95
LED75  (via drill 0.6 pad 1.2)
  Top 0.3: DR4.8 38.61,185.58 53.19,185.58 53.19,197.53 v46.19,197.53 | v29.78,183.55 RGB26.R
  Bottom 0.3: v46.19,197.53 53.19,197.53 53.19,186.74 39.29,186.74 39.29,188.06 34.23,188.06 34.23,187.03 32.82,187.03 32.82,184.2 29.78,184.2 v29.78,183.55
LED76  (via drill 0.6 pad 1.2)
  Top 0.3: DR4.9 39.26,186.34 52.48,186.34 52.48,196.69 47.13,196.69 v47.13,195.57 | v31.58,185.35 RGB26.G
  Bottom 0.3: v47.13,195.57 47.13,196.69 52.47,196.69 52.47,187.43 40.06,187.43 40.06,188.76 33.49,188.76 33.49,187.71 31.58,187.71 v31.58,185.35
LED77  (via drill 0.6 pad 1.2)
  Top 0.3: DR4.10 39.91,187.07 51.73,187.07 51.73,195.62 v48.72,195.62 | v21.13,186.35 21.13,185.35 RGB26.B
  Bottom 0.3: v48.72,195.62 51.73,195.62 51.73,188.12 40.89,188.12 40.89,189.58 32.76,189.58 32.76,188.43 30.72,188.43 30.72,186.35 v21.13,186.35
LED78  (via drill 0.6 pad 1.2)
  Top 0.3: DR4.11 40.56,187.78 50.99,187.78 50.99,194.43 v50.24,194.43 | v29.07,187.96 RGB27.R
  Bottom 0.3: v29.07,187.96 30.03,187.96 30.03,189.17 32,189.17 32,190.25 41.62,190.25 41.62,188.8 50.99,188.8 50.99,194.43 v50.24,194.43
LED79  (via drill 0.6 pad 1.2)
  Top 0.3: DR4.12 41.21,188.49 49.92,188.49 v49.92,192.46 | v29.05,189.75 RGB27.G
  Bottom 0.3: v49.92,192.46 49.92,189.51 42.35,189.51 42.35,190.92 31.22,190.92 31.22,190.05 29.05,190.05 v29.05,189.75
LED80  (via drill 0.6 pad 1.2)
  Top 0.3: DR4.13 41.86,189.18 48.74,189.18 v48.74,193.79 | v20.58,189.75 RGB27.B
  Bottom 0.3: v48.74,193.79 48.74,190.23 43.09,190.23 43.09,191.61 30.23,191.61 30.23,190.95 20.63,190.95 20.63,189.75 v20.58,189.75
LED81  (via drill 0.6 pad 1.2)
  Top 0.3: DR4.14 42.51,189.85 47.62,189.85 v47.62,192.03 | v29.25,192.03 29.25,192.35 RGB28.R
  Bottom 0.3: v47.62,192.03 47.62,190.95 43.86,190.95 43.86,192.34 29.25,192.34 v29.25,192.03
LED82  (via drill 0.6 pad 1.2)
  Top 0.3: DR4.15 43.16,190.49 46.32,190.49 v46.32,193.74 | v29.44,194.52 29.44,194.15 RGB28.G
  Bottom 0.3: v46.32,193.74 46.32,193.93 29.45,193.93 v29.45,194.52 v29.44,194.52
LED83  (via drill 0.6 pad 1.2)
  Top 0.3: DR4.16 43.81,191.15 45.02,191.15 v45.02,192.01 | v20.96,194.15 RGB28.B
  Bottom 0.3: v45.02,192.01 45.02,193.17 20.96,193.17 v20.96,194.15
LED84  (via drill 0.6 pad 1.2)
  Top 0.3: DR4.17 43.81,200.4 45.61,200.4 v45.61,199.43 | v28.91,196.69 28.91,196.75 RGB29.R
  Bottom 0.3: v45.61,199.43 45.09,199.43 45.09,194.66 30.73,194.66 30.73,195.71 28.91,195.71 v28.91,196.69
LED85  (via drill 0.6 pad 1.2)
  Top 0.3: DR4.18 43.16,201.11 46.98,201.11 v46.98,199.01 | v29.2,198.55 RGB29.G
  Bottom 0.3: v46.98,199.01 46.98,201.11 44.43,201.11 44.43,195.33 31.43,195.33 31.43,196.45 29.98,196.45 29.98,198.55 v29.2,198.55
LED86  (via drill 0.6 pad 1.2)
  Top 0.3: DR4.19 42.51,201.77 48.07,201.77 v48.07,200.86 | v21.03,198.55 RGB29.B
  Bottom 0.3: v48.07,200.86 48.07,201.77 43.71,201.77 43.71,196.02 32.13,196.02 32.13,197.09 30.67,197.09 30.67,199.97 21.03,199.97 v21.03,198.55
LED87  (via drill 0.6 pad 1.2)
  Top 0.3: DR4.20 41.86,202.44 49.32,202.44 v49.32,199.03 | v29.48,201.15 RGB30.R
  Bottom 0.3: v49.32,199.03 49.32,202.44 42.99,202.44 42.99,196.72 32.85,196.72 32.85,197.84 31.43,197.84 31.43,200.72 29.48,200.72 v29.48,201.15
LED88  (via drill 0.6 pad 1.2)
  Top 0.3: DR4.21 41.21,203.17 50.51,203.17 v50.51,200.88 | v29.81,202.95 RGB30.G
  Bottom 0.3: v50.51,200.88 50.51,203.18 42.32,203.18 42.32,197.39 33.59,197.39 33.59,198.61 32.17,198.61 32.17,201.52 30.7,201.52 30.7,202.95 v29.81,202.95
LED89  (via drill 0.6 pad 1.2)
  Top 0.3: DR4.22 40.56,203.87 51.69,203.87 v51.69,198.99 | v20.53,202.95 RGB30.B
  Bottom 0.3: v51.69,198.99 51.69,203.88 41.55,203.88 41.55,198.14 34.42,198.14 34.42,199.36 32.95,199.36 32.95,202.38 31.48,202.38 31.48,204.03 20.53,204.03 v20.53,202.95
LED90  (via drill 0.6 pad 1.2)
  Top 0.3: DR4.23 39.91,204.56 53.05,204.56 v53.05,201.27 | v30.06,205.55 RGB31.R
  Bottom 0.3: v53.05,201.27 53.05,204.56 40.92,204.56 40.92,198.79 35.16,198.79 35.16,200.15 33.73,200.15 33.73,203.24 32.25,203.24 32.25,204.82 30.06,204.82 v30.06,205.55
LED91  (via drill 0.6 pad 1.2)
  Top 0.3: DR4.24 39.26,206.09 v40.81,206.09 | v31.17,207.35 RGB31.G
  Bottom 0.3: v40.81,206.09 40.14,206.09 40.14,199.57 35.94,199.57 35.94,200.96 34.46,200.96 34.46,204 32.99,204 32.99,205.69 31.17,205.69 v31.17,207.35
LED92  (via drill 0.6 pad 1.2)
  Top 0.3: DR4.25 38.61,207.19 42.67,207.19 v42.67,205.8 | v20.49,207.35 RGB31.B
  Bottom 0.3: v42.67,205.8 42.67,207.19 39.38,207.19 39.38,200.29 36.64,200.29 36.64,201.69 35.21,201.69 35.21,204.74 33.73,204.74 33.73,206.47 32.55,206.47 32.55,208.63 20.49,208.63 v20.49,207.35
LED93  (via drill 0.6 pad 1.2)
  Top 0.3: DR4.26 37.96,208.37 44.09,208.37 v44.09,207.27 | RGB32.R v30.04,209.95
  Bottom 0.3: v44.09,207.27 44.09,208.37 38.69,208.37 38.69,200.97 37.36,200.97 37.36,202.39 35.96,202.39 35.96,205.52 34.44,205.52 34.44,207.16 33.24,207.16 33.24,209.45 30.04,209.45 v30.04,209.95
LED94  (via drill 0.6 pad 1.2)
  Top 0.3: DR4.27 37.31,209.1 45.54,209.1 45.54,205.75 v44.83,205.75 | v31.24,211.75 RGB32.G
  Bottom 0.3: v44.83,205.75 45.54,205.75 45.54,209.1 37.89,209.1 37.89,203.4 36.7,203.4 36.7,206.22 35.13,206.22 35.13,207.92 34.01,207.92 34.01,210.43 31.24,210.43 v31.24,211.75
LED95  (via drill 0.6 pad 1.2)
  Top 0.3: DR4.28 36.66,209.83 46.93,209.83 v46.93,208.05 | v20.45,211.75 RGB32.B
  Bottom 0.3: v46.93,208.05 46.93,209.83 37.19,209.83 37.19,207.1 35.87,207.1 35.87,208.61 34.85,208.61 34.85,211.19 32.97,211.19 32.97,213.47 20.45,213.47 v20.45,211.75
N$1  (via drill 0.6 pad 1.2)
  Top 0.3: v34.93,50.75 34.93,50.46 IC1.20
  Bottom 0.3: 26.84,14.47 26.84,23.79 24.65,23.79 24.65,40.18 34.93,50.46 v34.93,50.75
  Bottom 0.406: RESET.4 26.84,14.47
N$5
  Top 1: NAT_SEM_REGULATOR1.ADJ 15.97,34.48 15.97,30.97 7.55,30.97 7.55,28.95 | 7.55,28.95 RADJ2.2 | 7.55,28.95 7.55,23.98 RADJ1.2
N$22
  Top 1: NAT_SEM_REGULATOR1.VIN 19.31,37.48 CADJ1.1
  Bottom 1: CADJ1.1 23.5,30.71 23.5,19.63 21.11,19.63 SUPLY.2
OUT
  Bottom 0.3: RTC.7 45.14,50.63 45.14,60.93 51.33,60.93 ROUT.1
PEN  (via drill 0.6 pad 1.2)
  Top 0.3: v25.61,22.24 27.47,22.24 27.47,34.92 IC1.1
  Bottom 0.3: 25.61,14.44 v25.61,22.24
  Bottom 0.406: PEN.3 25.61,14.44
RX  (via drill 0.6 pad 1.2)
  Top 0.3: RS-1.13 57.35,40.8 57.35,38.07 56.31,38.07 56.31,34.24 v52.62,34.24
  Bottom 0.3: 47.57,18.17 48.63,18.17 48.63,34.25 v52.62,34.25 v52.62,34.24
  Bottom 0.406: 47.57,18.17 46.8,18.17 RS232.2
RXU
  Top 0.3: RS-1.9 52.99,35.35 28.18,35.35 IC1.2
SCL
  Top 0.3: RTC.6 31.98,53.17 IC1.25
  Bottom 0.3: RTC.6 49.54,53.17 49.54,60.14 54.78,60.14 RSCL.1
SCLK  (via drill 0.6 pad 1.2)  (1 unrouted)
  Top 0.3: DR2.3 35.36,112.12 33.54,112.12 33.54,119.66 30.74,119.66 30.74,121.15 28.41,121.15 28.41,122.64 29.39,122.64 29.39,125.64 32.48,125.64 v32.48,124.89 | DR3.3 35.36,146.04 48.52,146.04 48.52,148.52 48.8,148.52 48.8,149.89 53.47,149.89 v53.47,163.84 | DR4.3 35.36,180.62 53.47,180.62 v53.47,181.56 | v56.21,159.27 56.21,158.51 55.61,158.51 55.61,152.26 56.5,152.26 56.5,150.77 57.03,150.77 v57.03,148.25 | v53.25,143.24 53.66,143.24 v53.66,125.46 | 32.75,40.96 IC1.11 32.74,40.97 v32.74,37.82 | v34.6,57.17 35.33,57.17 DR1.3 | v38.21,61.54 37.38,61.54 37.38,75.31 43.93,75.31 43.93,73.95 55.41,73.95 55.41,94.67 50.74,94.67 50.74,96.73 52.47,96.73 52.47,102.9 50.38,102.9 50.38,104.44 48.42,104.44 48.42,105.8 53.8,105.8 53.8,113.14 60.34,113.14 60.34,122.67 58.13,122.67 v58.13,125.46 | 32.74,40.92 32.75,40.92
  Bottom 0.3: v53.47,181.56 v53.47,163.84 53.47,159.27 v56.21,159.27 | v57.03,148.25 57.03,147.89 53.25,147.89 v53.25,143.24 | v32.75,37.81 v32.74,37.82 32.74,36.34 | 29.6,44.07 29.6,44.06 | 29.6,44.07 35.21,49.68 36.5,49.68 | 36.5,49.68 36.54,49.68 | 36.5,49.68 36.5,55.4 35,55.4 35,57.17 v34.6,57.17 32.06,57.17 | 32.74,12.76 32.74,36.28 32.74,36.34 | 32.06,57.17 32.06,60.24 38.21,60.24 v38.21,61.54 | v58.13,125.46 v53.66,125.46 53.66,124.35 45.09,124.35 45.09,124.15 42.64,124.15 42.64,123.6 35.47,123.6 35.47,124.89 v32.48,124.89 | 32.06,57.17 32.06,57.16 | 29.6,44.07 28.54,43.01 28.54,36.34 32.74,36.34
  Bottom 0.406: 32.74,12.76 49.33,12.76 RS232.1
SDA
  Top 0.3: IC1.26 31.76,54.08 45.04,54.08 45.04,55.71 RTC.5 47.38,55.71 47.38,60.11 58.63,60.11 RSDA.1
SIN0  (via drill 0.6 pad 1.2)
  Top 0.3: DR1.4 35.98,56.71 v40.36,56.71 | IC1.12 34,40.84 37.38,40.84 37.38,42.72 42.03,42.72 42.03,52.15 40.35,52.15 v40.35,52.08
  Bottom 0.3: v40.36,56.71 v40.36,52.08 v40.35,52.08
SOUT0  (via drill 0.6 pad 1.2)
  Top 0.3: DR1.29 35.98,108.37 42.04,108.37 v42.04,106.56 | v35.34,111.02 36.01,111.02 DR2.4
  Bottom 0.3: v42.04,106.56 42.04,108.37 35.34,108.37 v35.34,111.02
SOUT1  (via drill 0.6 pad 1.2)
  Top 0.3: DR2.29 36.01,142.58 42.12,142.58 v42.12,141.63 | v47.6,149.35 47.6,146.76 36,146.76 DR3.4
  Bottom 0.3: v42.12,141.63 42.12,142.58 35.98,142.58 35.98,143.39 31.1,143.39 31.1,144.1 32.58,144.1 32.58,146.02 33.47,146.02 33.47,146.78 47.6,146.78 v47.6,149.35
SOUT2  (via drill 0.6 pad 1.2)
  Top 0.3: DR3.29 36.01,174.64 49.85,174.64 v49.85,171.52 | v45.21,184.44 45.21,181.5 36.01,181.5 DR4.4
  Bottom 0.3: v49.85,171.52 49.85,174.64 36.01,174.64 36.01,176.23 34.2,176.23 34.2,178.57 31.72,178.57 31.72,179.8 33.34,179.8 33.34,181.02 35.83,181.02 35.83,183.85 38.15,183.85 38.15,181.51 45.21,181.51 v45.21,184.44
TX  (via drill 0.6 pad 1.2)
  Top 0.3: RS-1.8 46.2,38.2 | v46.2,37.25 46.2,38.2 | 46.2,38.2 46.2,38.21
  Bottom 0.3: v46.2,37.25 46.2,35.57 46.94,35.57 46.94,19.31
  Bottom 0.406: 46.94,19.31 44.25,19.31 RS232.3
TXU  (via drill 0.6 pad 1.2)
  Top 0.3: v51.83,36.95 51.83,36.05 28.61,36.05 IC1.3 | v55.01,36.67 55.01,39.5 RS-1.11
  Bottom 0.3: v55.01,36.67 55.01,36.31 51.83,36.31 v51.83,36.95
V+  (via drill 0.6 pad 1.2)
  Top 0.3: RS-1.3 39.88,41.45 39.88,40.08 36.4,40.08 36.4,39.25 35.53,39.25 v35.53,38.46
  Bottom 0.3: v35.53,38.46 34.06,38.46 34.06,23.78 C3.1
V-  (via drill 0.6 pad 1.2)
  Top 0.3: RS-1.7 44.63,38.85 v44.63,37.42
  Bottom 0.3: v44.63,37.42 44.63,37.25 41.52,37.25 41.52,34.08 C4.1
VCC  (via drill 0.6 pad 1.2, 1 pad 3)  (5 unrouted)
  Top 0.3: RGB6.VCC 22.53,95.55 | DR2.32 34.06,130 v32.69,130 | v21.54,130.74 RGB14.VCC 18.88,130.74 | DR3.32 34.06,169.04 34.05,169.04 | 34.05,169.04 21.6,169.04 | 21.6,169.04 21.6,170.35 RGB23.VCC | 20.96,199.97 32.81,199.97 32.81,200.96 34.06,200.96 DR4.32 34.06,211.88 50.03,211.88 50.03,206.93 52.54,206.93 v52.54,207.79 | 20.96,199.97 20.96,201.15 RGB30.VCC | 34.05,169.04 34.05,177.04 60.13,177.04 60.13,168.56 60.79,168.56 60.79,160.17 63.17,160.17 v63.17,156.94 63.17,154.87 60.73,154.87 60.73,146.92 61.8,146.92 61.8,137.82 CDR2.2 | ENC.1 13.15,60.45 RCHA.1 13.1,56.2 RCHB.1 RCHI.1 11.78,46.82 CADJ2.2 15.24,40.95 IC1.52 | RS-1.15 54.33,42.1 54.33,42.75 | 54.33,42.75 RS-1.16 | RS-1.12 56.3,40.16 v56.3,39.37 | v56.3,42.64 56.3,42.75 54.33,42.75 | v20.91,33.34 21.2,33.34 IC1.64 | 16.58,89.85 CDR1.2 | 16.58,90.92 16.58,89.85 | 16.58,90.92 16.58,95.55 18.88,95.55 | 18.88,95.55 22.53,95.55 | RGB5.VCC 23.58,90.92 16.58,90.92 | IC1.21 33.45,50.11 v33.45,50.66 | v13.16,64.92 v13.15,64.92 13.15,65.22 | 13.15,65.22 13.15,89.85 16.58,89.85 | 18.88,99.94 RGB7.VCC | 18.88,99.94 18.88,95.55 | 18.88,104.34 RGB8.VCC | 18.88,104.34 18.88,99.94 | 18.88,108.74 RGB9.VCC | 18.88,108.74 18.88,104.34 | 18.88,113.14 RGB10.VCC | 18.88,113.14 18.88,108.74 | 18.88,117.54 RGB11.VCC | 18.88,117.54 18.88,113.14 | 18.88,121.94 RGB12.VCC | 18.88,121.94 18.88,117.54 | 18.88,126.34 RGB13.VCC | 18.88,126.34 18.88,121.94 | 18.88,130.74 18.88,126.34 | 18.88,135.14 RGB15.VCC | 18.88,135.14 18.88,130.74 | 18.88,139.54 RGB16.VCC | 18.88,139.54 18.88,135.14 | 18.88,143.94 RGB17.VCC | 18.88,143.94 18.88,139.54 | 18.88,148.34 RGB18.VCC | 18.88,148.34 18.88,143.94
  Top 0.3: 18.88,152.74 RGB19.VCC | 18.88,152.74 18.88,148.34 | 18.88,157.14 RGB20.VCC | 18.88,157.14 18.88,152.74 | 18.88,161.54 RGB21.VCC | 18.88,161.54 18.88,157.14 | 21.6,169.04 18.88,169.04 | 18.88,169.04 18.88,165.95 | 18.88,165.95 RGB22.VCC | 18.88,165.95 18.88,161.54 | 18.88,174.75 RGB24.VCC | 18.88,169.04 18.88,174.75 | 18.88,179.15 RGB25.VCC | 18.88,174.75 18.88,179.15 | 18.88,183.55 RGB26.VCC | 18.88,179.15 18.88,183.55 | 18.88,187.95 RGB27.VCC | 18.88,183.55 18.88,187.95 | 18.88,192.35 RGB28.VCC | 18.88,187.95 18.88,192.35 | 18.88,196.75 RGB29.VCC | 18.88,192.35 18.88,196.75 | 18.88,199.97 20.96,199.97 | 18.88,196.75 18.88,199.97 | 18.88,205.55 RGB31.VCC | 18.88,199.97 18.88,205.55 | RGB32.VCC 23.23,209.95 23.23,209.85 18.88,209.85 18.88,205.55 | 13.15,65.22 v17.38,65.22 | DR1.32 34.03,94.35 22.53,94.35 22.53,95.55
  Top 1: NAT_SEM_REGULATOR1.VOUT 17.46,35.98 17.46,23.98
  Bottom 0.3: v32.69,130 32.69,130.13 28.65,130.13 28.65,130.74 v21.54,130.74 | v52.54,207.79 55.86,207.79 55.86,204.79 55.67,204.79 55.67,191.26 57.42,191.26 CDR4.2 | v63.17,156.94 CDR3.2 | C5.1 v56.3,39.37 v56.3,42.64 56.3,43.78 50.43,43.78 50.43,48.09 | 11.78,35.91 CADJ2.2 11.78,41.23 15.51,41.23 19.52,45.23 28.56,45.23 33.45,50.12 v33.45,50.66 | ROUT.2 RSCL.2 54.78,67.42 RSDA.2 60.67,67.43 60.67,59.22 50.43,59.22 50.43,48.09 | 50.43,48.09 RTC.8 | v13.16,64.92 v13.15,64.92 RCHA.1
  Bottom 0.406: C5.1 | RADJ1.1 10.42,23.98 10.42,31.72 | 10.42,31.72 10.42,35.91 11.78,35.91 | 10.42,31.72 18.2,31.72 18.2,32.22 20.91,32.22 v20.91,33.34
  Bottom 1: RADJ1.1 12.69,7.75 56.63,7.75 56.63,19.47 50.22,19.47 50.22,26.71 53.79,26.71 53.79,30.28 60.2,30.28 60.2,33.01 61.65,33.01 C5.1
X1
  Bottom 0.3: RTC.1 CR1.1
X2
  Bottom 0.3: RTC.2 61.56,50.63 CR1.2
XLAT  (via drill 0.6 pad 1.2)
  Top 0.3: DR1.30 35.33,109.09 43.33,109.09 v43.33,108.22 | DR2.30 35.36,143.25 44.31,143.25 v44.31,141.66 | DR3.30 35.36,175.48 54.61,175.48 54.61,173.4 v54.98,173.4 | DR4.30 35.36,210.53 48.48,210.53 48.48,205.49 v54.76,205.49 | v56.1,161.42 54.98,161.42 54.98,151.55 55.82,151.55 v55.82,149.91 | v42.09,56.05 42.09,57.92 36.7,57.92 36.7,76.11 44.74,76.11 44.74,74.69 54.7,74.69 54.7,93.85 49.93,93.85 49.93,97.52 51.77,97.52 51.77,102.13 49.63,102.13 49.63,103.55 47.56,103.55 47.56,104.54 45.4,104.54 45.4,106.71 v45.99,106.71 53,106.71 53,113.99 59.59,113.99 59.59,121.98 57.05,121.98 57.05,133.08 63.74,133.08 63.74,144.25 65.13,144.25 65.13,146.84 62.62,146.84 62.62,147.69 61.55,147.69 61.55,149.08 62.66,149.08 v62.66,149.91 61.49,149.91 61.49,154.04 64.53,154.04 64.53,160.87 61.71,160.87 v61.71,170.27 v61.71,170.28 | v30.67,37.38 31.31,37.38 31.31,38.57 31.95,38.57 31.95,40.63 IC1.10
  Bottom 0.3: v44.31,141.66 43.58,141.66 43.58,143.38 36.93,143.38 36.93,144.34 33.57,144.34 33.57,144.9 34.4,144.9 34.4,145.94 48.89,145.94 48.89,149.91 v55.82,149.91 v62.66,149.91 | v54.76,205.49 54.98,205.49 v54.98,173.4 54.98,169.16 | 54.98,169.16 54.98,161.42 v56.1,161.42 | v43.33,108.22 45.99,108.22 v45.99,106.71 | v42.09,56.05 42.09,44.91 v37.66,44.91 37.66,41.84 34.4,41.84 34.4,39.58 30.67,39.58 v30.67,37.38 | 54.98,169.16 61.71,169.16 v61.71,170.27 v61.71,170.28
XTAL1  (via drill 0.6 pad 1.2)
  Top 0.3: v39.36,48.47 37.43,48.47 37.43,52.55 32.5,52.55 IC1.24
  Bottom 0.3: CAT1.2 62.18,82.55 62.18,71.09 CR2.2 58.99,69.01 49.8,69.01 49.8,62 44.4,62 44.4,58.43 39.36,58.43 39.36,58.35 38.83,58.35 38.83,48.47 v39.36,48.47
XTAL2  (via drill 0.6 pad 1.2)
  Top 0.3: v37.61,47.34 36.52,47.34 36.52,51.88 32.96,51.88 IC1.23
  Bottom 0.3: v37.61,47.34 38.14,47.34 38.14,59.3 43.57,59.3 43.57,63.01 48.98,63.01 48.98,70 52.49,70 CR2.1 56.18,71.09 56.18,72.15 56.93,72.15 56.93,73.43 60.61,73.43 CAT2.2

## Text on the board
tPlace: Patricio | Jose | Helder